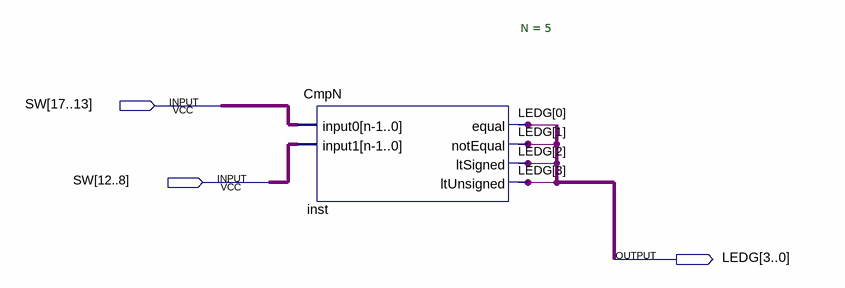
[diagram p0: schematic sheet]
// Quartus schematic CmpN_Demo.bdf as structural Verilog: 1 symbols, 3 pins
module CmpN_Demo (
  input  [17:8] SW,
  output [3:0] LEDG
);

  CmpN #(.N(5)) inst (
    .input0(SW[17:13]), .input1(SW[12:8]), .equal(LEDG[0]), .notEqual(LEDG[1]), .ltSigned(LEDG[2]),
    .ltUnsigned(LEDG[3]));
endmodule
